# EAGLE schematic Gambar Teknik EAGLE_DRAJAD PAMUNGKAS (EAGLE 9.6.2)
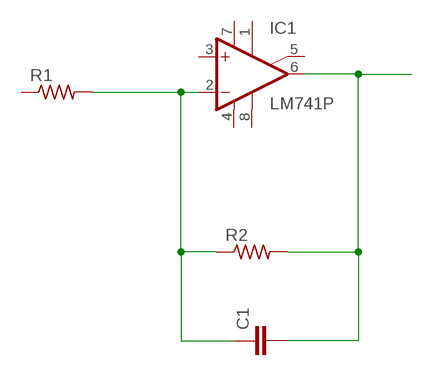
[diagram p0: schematic, sheet 1]

## Parts
C1  C2,5-3  [C2.5-3]
IC1  LM741P  [DIL08]
R1  R-US_0204/2V  [0204V]
R2  R-US_0204/2V  [0204V]

## Nets
N$1: C1.1 IC1.2(-IN) R1.2 R2.1
N$3: C1.2 IC1.6(OUT) R2.2
Unconnected: IC1.1(ON1) IC1.3(+IN) IC1.5(ON2) IC1.8(OPT) R1.1

## Power pins joined to a net without a drawn wire
V+: IC1.7(V+)
V-: IC1.4(V-)

## Library data of the parts
C1 = capacitor-wima:C: CAPACITOR naming: grid - package width
IC1 = linear:*741: OP AMP
R1 R2 = rcl:R-US_: RESISTOR, American symbol; SPICEPREFIX: R